# Altium schematic sheet MAX1104_TOP.SCHDOC
size B; Organization: Altium Limited; Address1: L3, 12a Rodborough Rd; Address2: Frenchs Forest; Address3: NSW; Address4: Australia 2086; DocumentNumber: 1; SheetNumber: 1; SheetTotal: 2
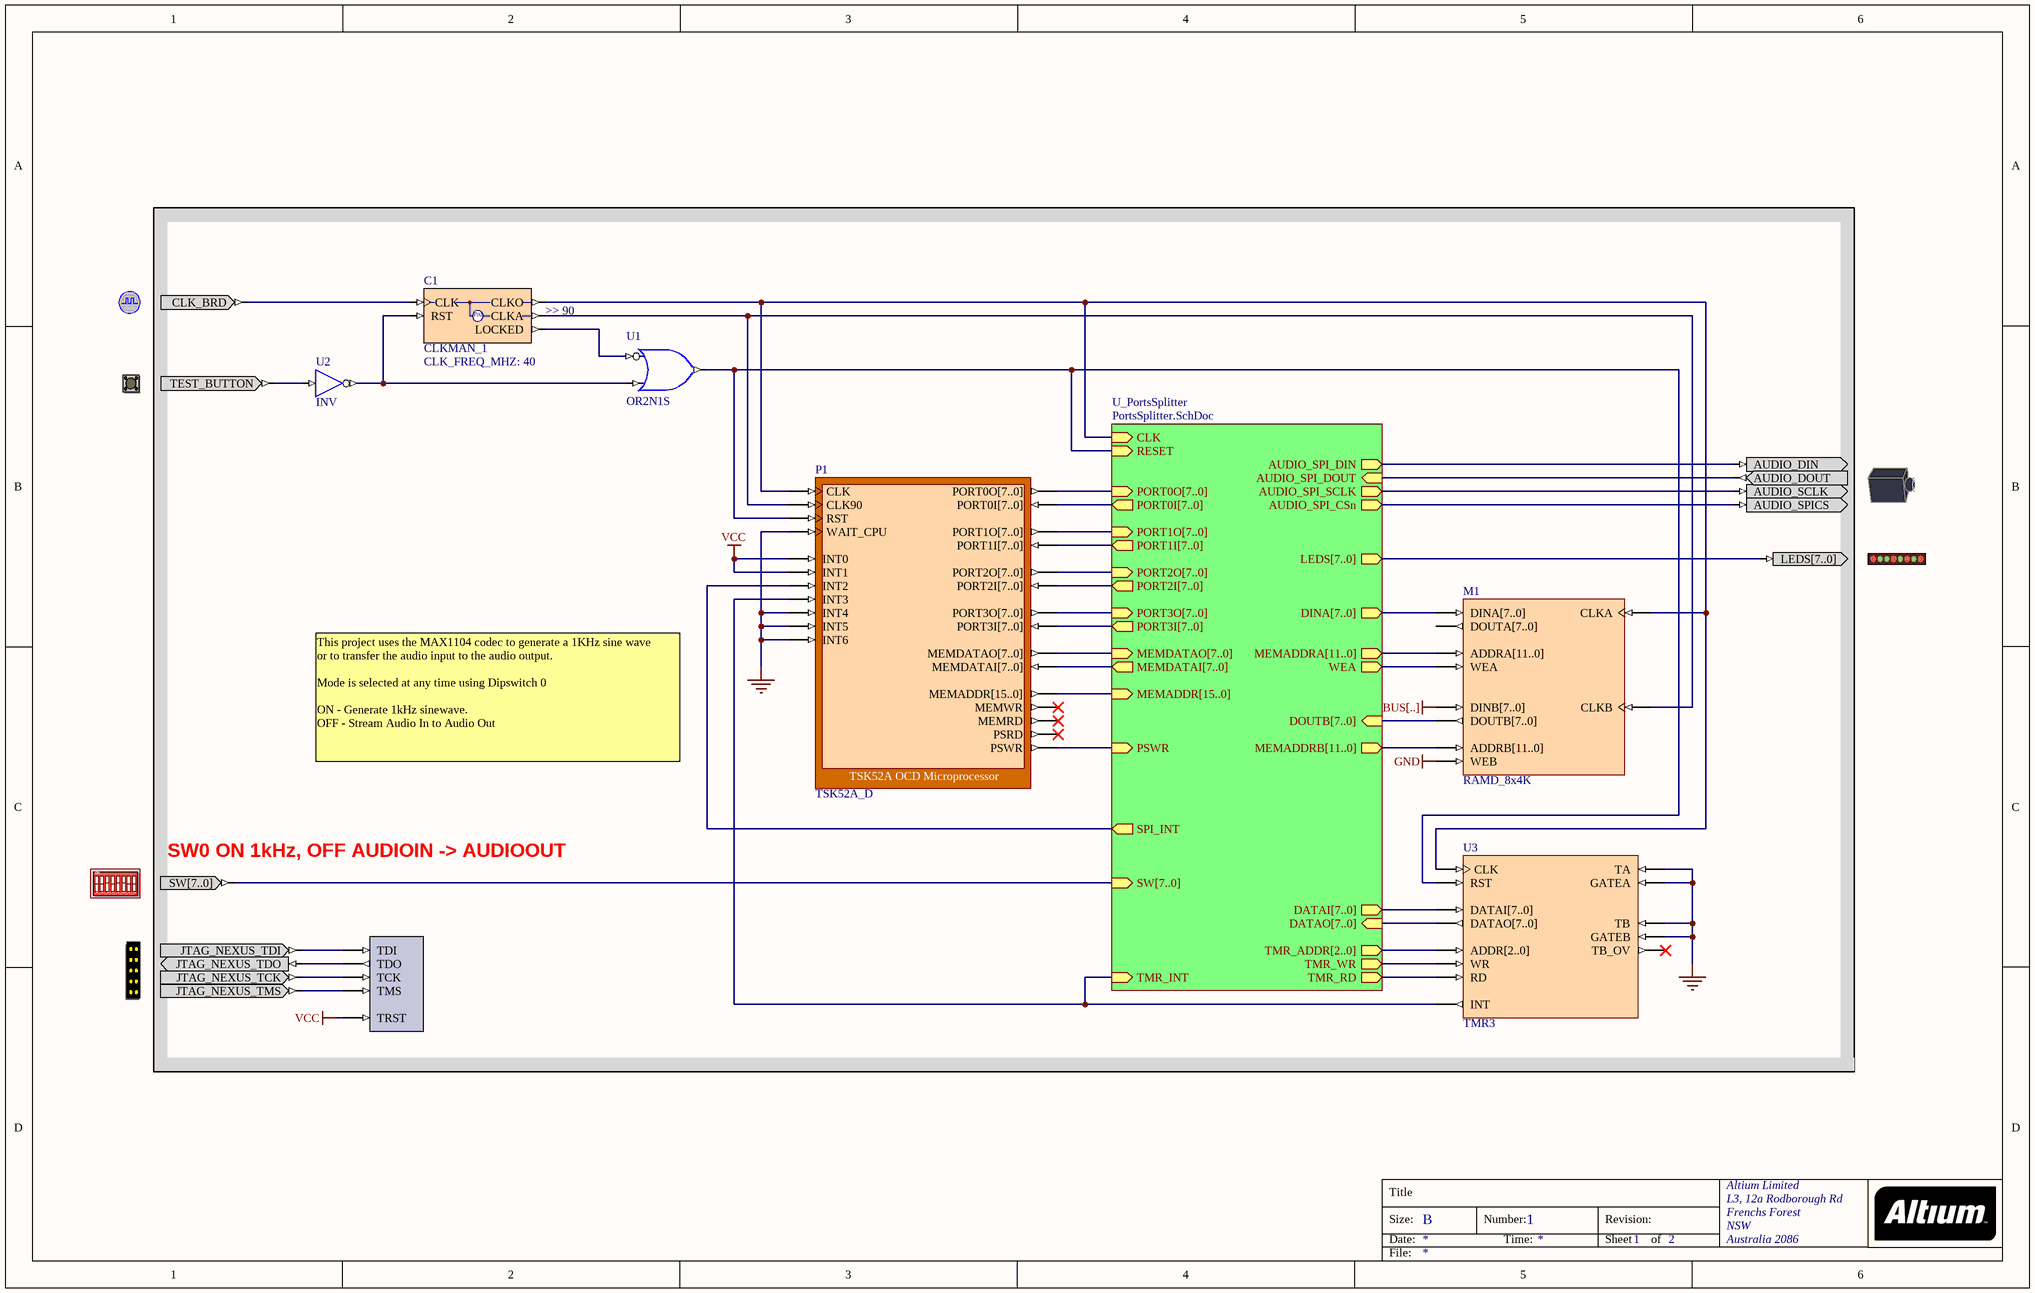
[diagram p0: MAX1104_TOP.SCHDOC]

## Parts
(Parts that share a designator on the sheet are numbered #1, #2 ... from top to bottom, then left to right.)
?#1  CLOCK_BOARD  (value not drawn)
?#2  TEST_BUTTON  (value not drawn)
?#3  AUDIO_DAC  (value not drawn)
?#4  LED  (value not drawn)
?#5  DIPSWITCH  (value not drawn)
?#6  NEXUS_JTAG_CONNECTOR  (value not drawn)
C1  CLKMAN_1  CLK_FREQ_MHZ: 40  ClkA_Operation: >> 90
M1  RAMD_8x4K
NEXUS_JTAG_PORT  NEXUS_JTAG_PORT  (value not drawn)
P1  TSK52A_D
U1  OR2N1S
U2  INV
U3  TMR3

## Blocks framed on the sheet
SW0 ON 1kHz, OFF AUDIOIN -> AUDIOOUT: ?#1-?#6 C1 M1 NEXUS_JTAG_PORT P1 U1-U3

## Sub-sheets
U_PortsSplitter = PortsSplitter.SchDoc: SW[7..0] (in), PORT1O[7..0] (in), PORT1I[7..0] (out), PORT2O[7..0] (in), PORT2I[7..0] (out), PORT3O[7..0] (in), PORT3I[7..0] (out), PORT0O[7..0] (in), PORT0I[7..0] (out), MEMDATAO[7..0] (in), MEMDATAI[7..0] (out), MEMADDR[15..0] (in), PSWR (in), WEA (out), MEMADDRA[11..0] (out), MEMADDRB[11..0] (out), DINA[7..0] (out), DOUTB[7..0] (in), DATAI[7..0] (out), DATAO[7..0] (in), TMR_ADDR[2..0] (out), TMR_WR (out), TMR_RD (out), LEDS[7..0] (out), SPI_INT (out), CLK (in), RESET (in), AUDIO_SPI_DIN (out), AUDIO_SPI_DOUT (in), AUDIO_SPI_SCLK (out), AUDIO_SPI_CSn (out), TMR_INT (in)

## Nets
GND: M1.WEB P1.INT4 P1.INT5 P1.INT6 P1.WAIT_CPU U3.GATEA U3.GATEB U3.TA U3.TB
GNDBUS[..]: M1.DINB[7..0]
VCC: NEXUS_JTAG_PORT.TRST P1.INT0 P1.INT1
Net?#1_CLK_BRD: ?#1.CLK_BRD C1.CLK
Net?#2_TEST_BUTTON: ?#2.TEST_BUTTON U2.I
Net?#3_AUDIO_DIN: ?#3.AUDIO_DIN ; sheet U_PortsSplitter/AUDIO_SPI_DIN
Net?#3_AUDIO_DOUT: ?#3.AUDIO_DOUT ; sheet U_PortsSplitter/AUDIO_SPI_DOUT
Net?#3_AUDIO_SCLK: ?#3.AUDIO_SCLK ; sheet U_PortsSplitter/AUDIO_SPI_SCLK
Net?#3_AUDIO_SPICS: ?#3.AUDIO_SPICS ; sheet U_PortsSplitter/AUDIO_SPI_CSn
Net?#4_LEDS[7..0]: ?#4.LEDS[7..0] ; sheet U_PortsSplitter/LEDS[7..0]
Net?#5_SW[7..0]: ?#5.SW[7..0] ; sheet U_PortsSplitter/SW[7..0]
Net?#6_JTAG_NEXUS_TCK: ?#6.JTAG_NEXUS_TCK NEXUS_JTAG_PORT.TCK
Net?#6_JTAG_NEXUS_TDI: ?#6.JTAG_NEXUS_TDI NEXUS_JTAG_PORT.TDI
Net?#6_JTAG_NEXUS_TDO: ?#6.JTAG_NEXUS_TDO NEXUS_JTAG_PORT.TDO
Net?#6_JTAG_NEXUS_TMS: ?#6.JTAG_NEXUS_TMS NEXUS_JTAG_PORT.TMS
NetC1_CLKA: C1.CLKA M1.CLKB P1.CLK90
NetC1_CLKO: C1.CLKO M1.CLKA P1.CLK U3.CLK ; sheet U_PortsSplitter/CLK
NetC1_LOCKED: C1.LOCKED U1.I0
NetC1_RST: C1.RST U1.I1 U2.O
NetM1_ADDRA[11..0]: M1.ADDRA[11..0] ; sheet U_PortsSplitter/MEMADDRA[11..0]
NetM1_ADDRB[11..0]: M1.ADDRB[11..0] ; sheet U_PortsSplitter/MEMADDRB[11..0]
NetM1_DINA[7..0]: M1.DINA[7..0] ; sheet U_PortsSplitter/DINA[7..0]
NetM1_DOUTB[7..0]: M1.DOUTB[7..0] ; sheet U_PortsSplitter/DOUTB[7..0]
NetM1_WEA: M1.WEA ; sheet U_PortsSplitter/WEA
NetP1_INT2: P1.INT2 ; sheet U_PortsSplitter/SPI_INT
NetP1_INT3: P1.INT3 U3.INT ; sheet U_PortsSplitter/TMR_INT
NetP1_MEMADDR[15..0]: P1.MEMADDR[15..0] ; sheet U_PortsSplitter/MEMADDR[15..0]
NetP1_MEMDATAI[7..0]: P1.MEMDATAI[7..0] ; sheet U_PortsSplitter/MEMDATAI[7..0]
NetP1_MEMDATAO[7..0]: P1.MEMDATAO[7..0] ; sheet U_PortsSplitter/MEMDATAO[7..0]
NetP1_PORT0I[7..0]: P1.PORT0I[7..0] ; sheet U_PortsSplitter/PORT0I[7..0]
NetP1_PORT0O[7..0]: P1.PORT0O[7..0] ; sheet U_PortsSplitter/PORT0O[7..0]
NetP1_PORT1I[7..0]: P1.PORT1I[7..0] ; sheet U_PortsSplitter/PORT1I[7..0]
NetP1_PORT1O[7..0]: P1.PORT1O[7..0] ; sheet U_PortsSplitter/PORT1O[7..0]
NetP1_PORT2I[7..0]: P1.PORT2I[7..0] ; sheet U_PortsSplitter/PORT2I[7..0]
NetP1_PORT2O[7..0]: P1.PORT2O[7..0] ; sheet U_PortsSplitter/PORT2O[7..0]
NetP1_PORT3I[7..0]: P1.PORT3I[7..0] ; sheet U_PortsSplitter/PORT3I[7..0]
NetP1_PORT3O[7..0]: P1.PORT3O[7..0] ; sheet U_PortsSplitter/PORT3O[7..0]
NetP1_PSWR: P1.PSWR ; sheet U_PortsSplitter/PSWR
NetP1_RST: P1.RST U1.O U3.RST ; sheet U_PortsSplitter/RESET
NetU3_ADDR[2..0]: U3.ADDR[2..0] ; sheet U_PortsSplitter/TMR_ADDR[2..0]
NetU3_DATAI[7..0]: U3.DATAI[7..0] ; sheet U_PortsSplitter/DATAI[7..0]
NetU3_DATAO[7..0]: U3.DATAO[7..0] ; sheet U_PortsSplitter/DATAO[7..0]
NetU3_RD: U3.RD ; sheet U_PortsSplitter/TMR_RD
NetU3_WR: U3.WR ; sheet U_PortsSplitter/TMR_WR

Not connected (* = marked no-connect by the designer): M1 DOUTA[7..0]; P1 MEMRD* MEMWR* PSRD*; U3 TB_OV*

## Notes on the sheet
- This project uses the MAX1104 codec to generate a 1KHz sine wave
  or to transfer the audio input to the audio output.
  Mode is selected at any time using Dipswitch 0
  ON - Generate 1kHz sinewave.
  OFF - Stream Audio In to Audio Out
- Title
- Size:
- Date:
- B
- Number:
- Time:
- Revision:
- Sheet
- of
- File:
- (in symbol CLKMAN_1) F(x)
- (in symbol DIPSWITCH) ON; 1; 2; 3; 4; 5; 6; 7; 8

## Library data of the parts
?#1 = CLOCK_BOARD: Global System Clock Supply; PortComponent: True; Published: 19-Nov-2003; Publisher: Altium Limited
?#2 = TEST_BUTTON: Test Button; PortComponent: True; Published: 19-Nov-2003; Publisher: Altium Limited
?#3 = AUDIO_DAC: Audio Jack; PortComponent: True; Published: 19-Nov-2003; Publisher: Altium Limited
?#4 = LED: 8-Way LEDS; PortComponent: True; Published: 19-Nov-2003; Publisher: Altium Limited
?#5 = DIPSWITCH: 8-Way Dip Switch; PortComponent: True; Published: 19-Nov-2003; Publisher: Altium Limited
?#6 = NEXUS_JTAG_CONNECTOR: JTAG Port; PortComponent: True; Published: 19-Nov-2003; Publisher: Altium Limited
C1 = CLKMAN_1: Single Operational Output Clock Manager; Clk_Count: 1; Published: 5-Jul-2004; Publisher: Altium Limited; Core Revision: 1.00.00; Nexus_Core: ClockManager; HelpURL: CR0118 FPGA Generic Library Guide.pdf#page=148; Functional Class: Clock Manager; Port Size: 1
M1 = RAMD_8x4K: Dual Port Random Access Memory; Memory_DepthA: 4096; Memory_Type: RAM_DualPortBlock; Memory_WidthA: 8; Memory_ClockEdge: Rising; Nexus_Core: Memory_Program; Published: 13/01/2004; Publisher: Altium Hobart Technology Center; Memory_DepthB: 4096; Memory_WidthB: 8
NEXUS_JTAG_PORT = NEXUS_JTAG_PORT: Nexus Processor JTAG Chain Connector; NEXUS_JTAG_CONNECTOR: True; Published: 5-Sep-2003; Publisher: Altium Hobart Technology Centre
P1 = TSK52A_D: TSK52A OCD Microprocessor; NEXUS_CORE: Processor_OCDS; NEXUS_JTAG_DEVICE: True; NEXUS_JTAG_ORDER: 0; ChildModel1: TSK52A_D_DRAM8X256; ChildCore1: M1; Published: 1/12/2003; Publisher: Altium Hobart Technology Centre; Core Revision: 1.00.00
U1 = OR2N1S: 2-Input OR Gate with Active Low A Input, Single Pin Version; Xilinx Equivalent: OR2B1; ArchiveName: GENERIC; Published: 18-Dec-2003; Publisher: Altium Limited; Core Revision: 1.00.00
U2 = INV: Inverter; ArchiveName: GENERIC; VHDLIB_SIM: GENERIC_LIB; Published: 29-Jan-2004; Publisher: Altium Limited; Xilinx Equivalent: INV; Core Revision: 1.00.00
U3 = TMR3: Timer 3; Published: 7/01/2004; Publisher: Altium Hobart Technology Centre; Core Revision: 1.00.00